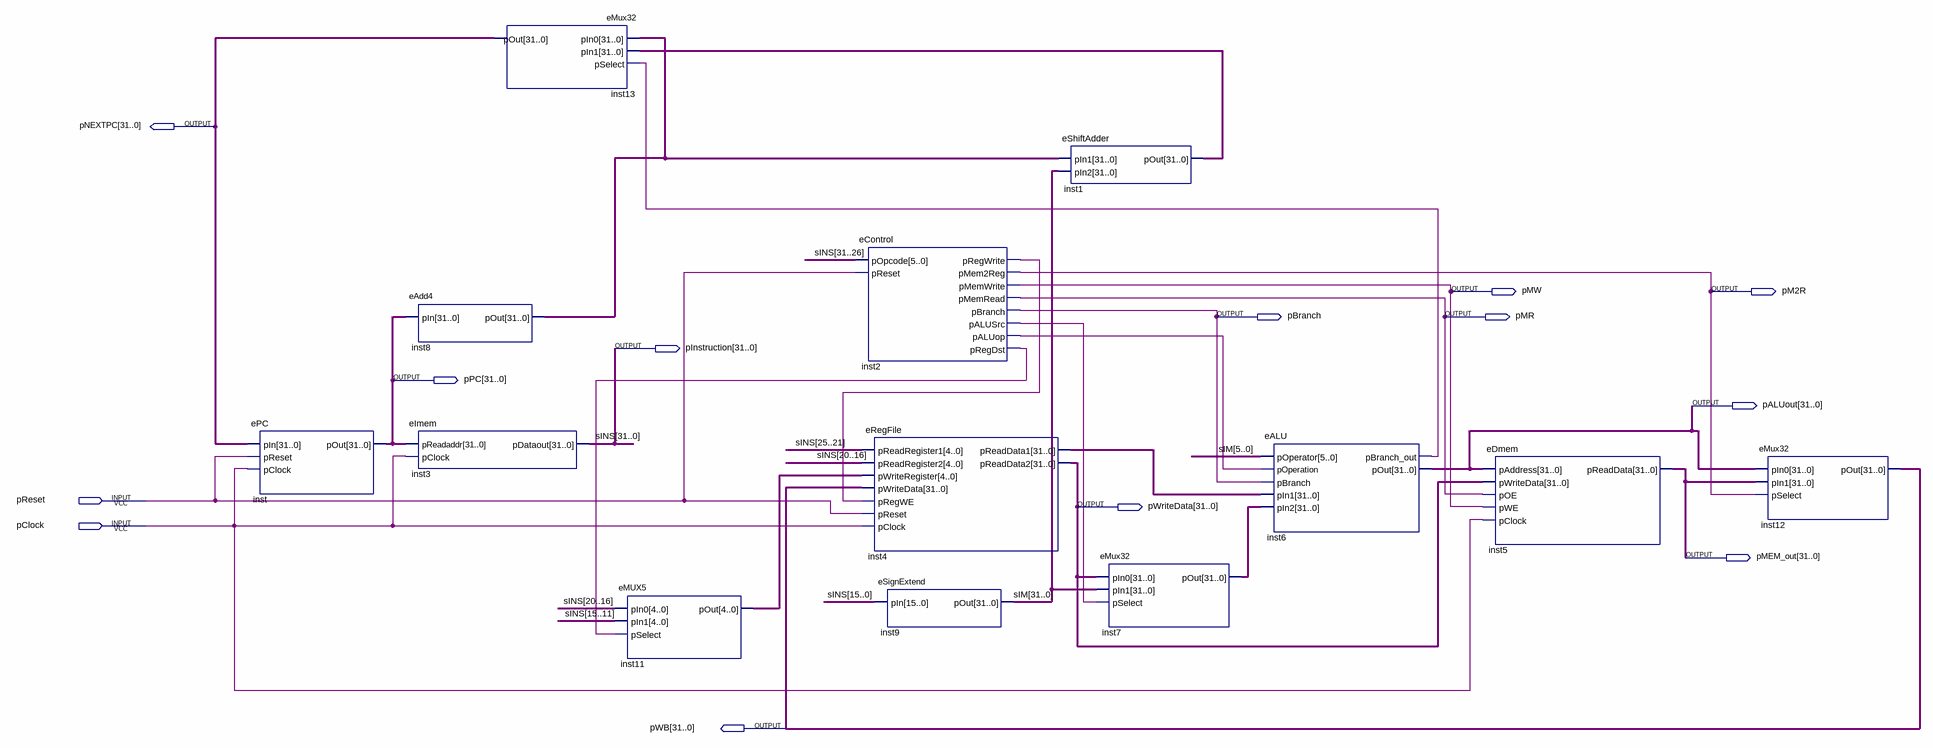
[diagram p0: schematic sheet]
// Quartus schematic single.bdf as structural Verilog: 13 symbols, 13 pins
module single (
  input  pReset,
  input  pClock,
  output [31:0] pNEXTPC,
  output pMW,
  output pM2R,
  output pBranch,
  output pMR,
  output [31:0] pInstruction,
  output [31:0] pPC,
  output [31:0] pALUout,
  output [31:0] pWriteData,
  output [31:0] pMEM_out,
  output [31:0] pWB
);

  wire inst2_paluop, inst2_palusrc, inst2_pregdst, inst2_pregwrite, inst6_pbranch_out;
  wire [4:0] inst11_pout;
  wire [31:0] inst1_pout, inst4_preaddata1, inst7_pout, inst8_pout, sIM;

  ePC inst (.pIn(pNEXTPC), .pReset(pReset), .pClock(pClock), .pOut(pPC));
  eAdd4 inst8 (.pIn(pPC), .pOut(inst8_pout));
  eImem inst3 (.pReadaddr(pPC), .pClock(pClock), .pDataout(pInstruction));
  eMux32 inst13 (.pIn0(inst8_pout), .pIn1(inst1_pout), .pSelect(inst6_pbranch_out), .pOut(pNEXTPC));
  eMUX5 inst11 (.pIn0(pInstruction[20:16]), .pIn1(pInstruction[15:11]), .pSelect(inst2_pregdst), .pOut(inst11_pout));
  eControl inst2 (
    .pOpcode(pInstruction[31:26]), .pReset(pReset), .pRegWrite(inst2_pregwrite), .pMem2Reg(pM2R),
    .pMemWrite(pMW), .pMemRead(pMR), .pBranch(pBranch), .pALUSrc(inst2_palusrc), .pALUop(inst2_paluop),
    .pRegDst(inst2_pregdst));
  eRegFile inst4 (
    .pReadRegister1(pInstruction[25:21]), .pReadRegister2(pInstruction[20:16]), .pWriteRegister(inst11_pout),
    .pWriteData(pWB), .pRegWE(inst2_pregwrite), .pReset(pReset), .pClock(pClock),
    .pReadData1(inst4_preaddata1), .pReadData2(pWriteData));
  eSignExtend inst9 (.pIn(pInstruction[15:0]), .pOut(sIM));
  eShiftAdder inst1 (.pIn1(inst8_pout), .pIn2(sIM), .pOut(inst1_pout));
  eMux32 inst7 (.pIn0(pWriteData), .pIn1(sIM), .pSelect(inst2_palusrc), .pOut(inst7_pout));
  eALU inst6 (
    .pOperator(sIM[5:0]), .pOperation(inst2_paluop), .pBranch(pBranch), .pIn1(inst4_preaddata1),
    .pIn2(inst7_pout), .pBranch_out(inst6_pbranch_out), .pOut(pALUout));
  eDmem inst5 (
    .pAddress(pALUout), .pWriteData(pWriteData), .pOE(pMR), .pWE(pMW), .pClock(pClock), .pReadData(pMEM_out));
  eMux32 inst12 (.pIn0(pALUout), .pIn1(pMEM_out), .pSelect(pM2R), .pOut(pWB));

  // Other names for the same wires on the sheet: sINS[31:0] = pInstruction
endmodule
